# EasyEDA schematic BIT 1.json
TITLE: TRICORE | ALU | LOGIC; REV: 1.0; Date: 2022-01-03; Sheet: 3/9; Drawn By: Koehler, Paul; Company: komed3
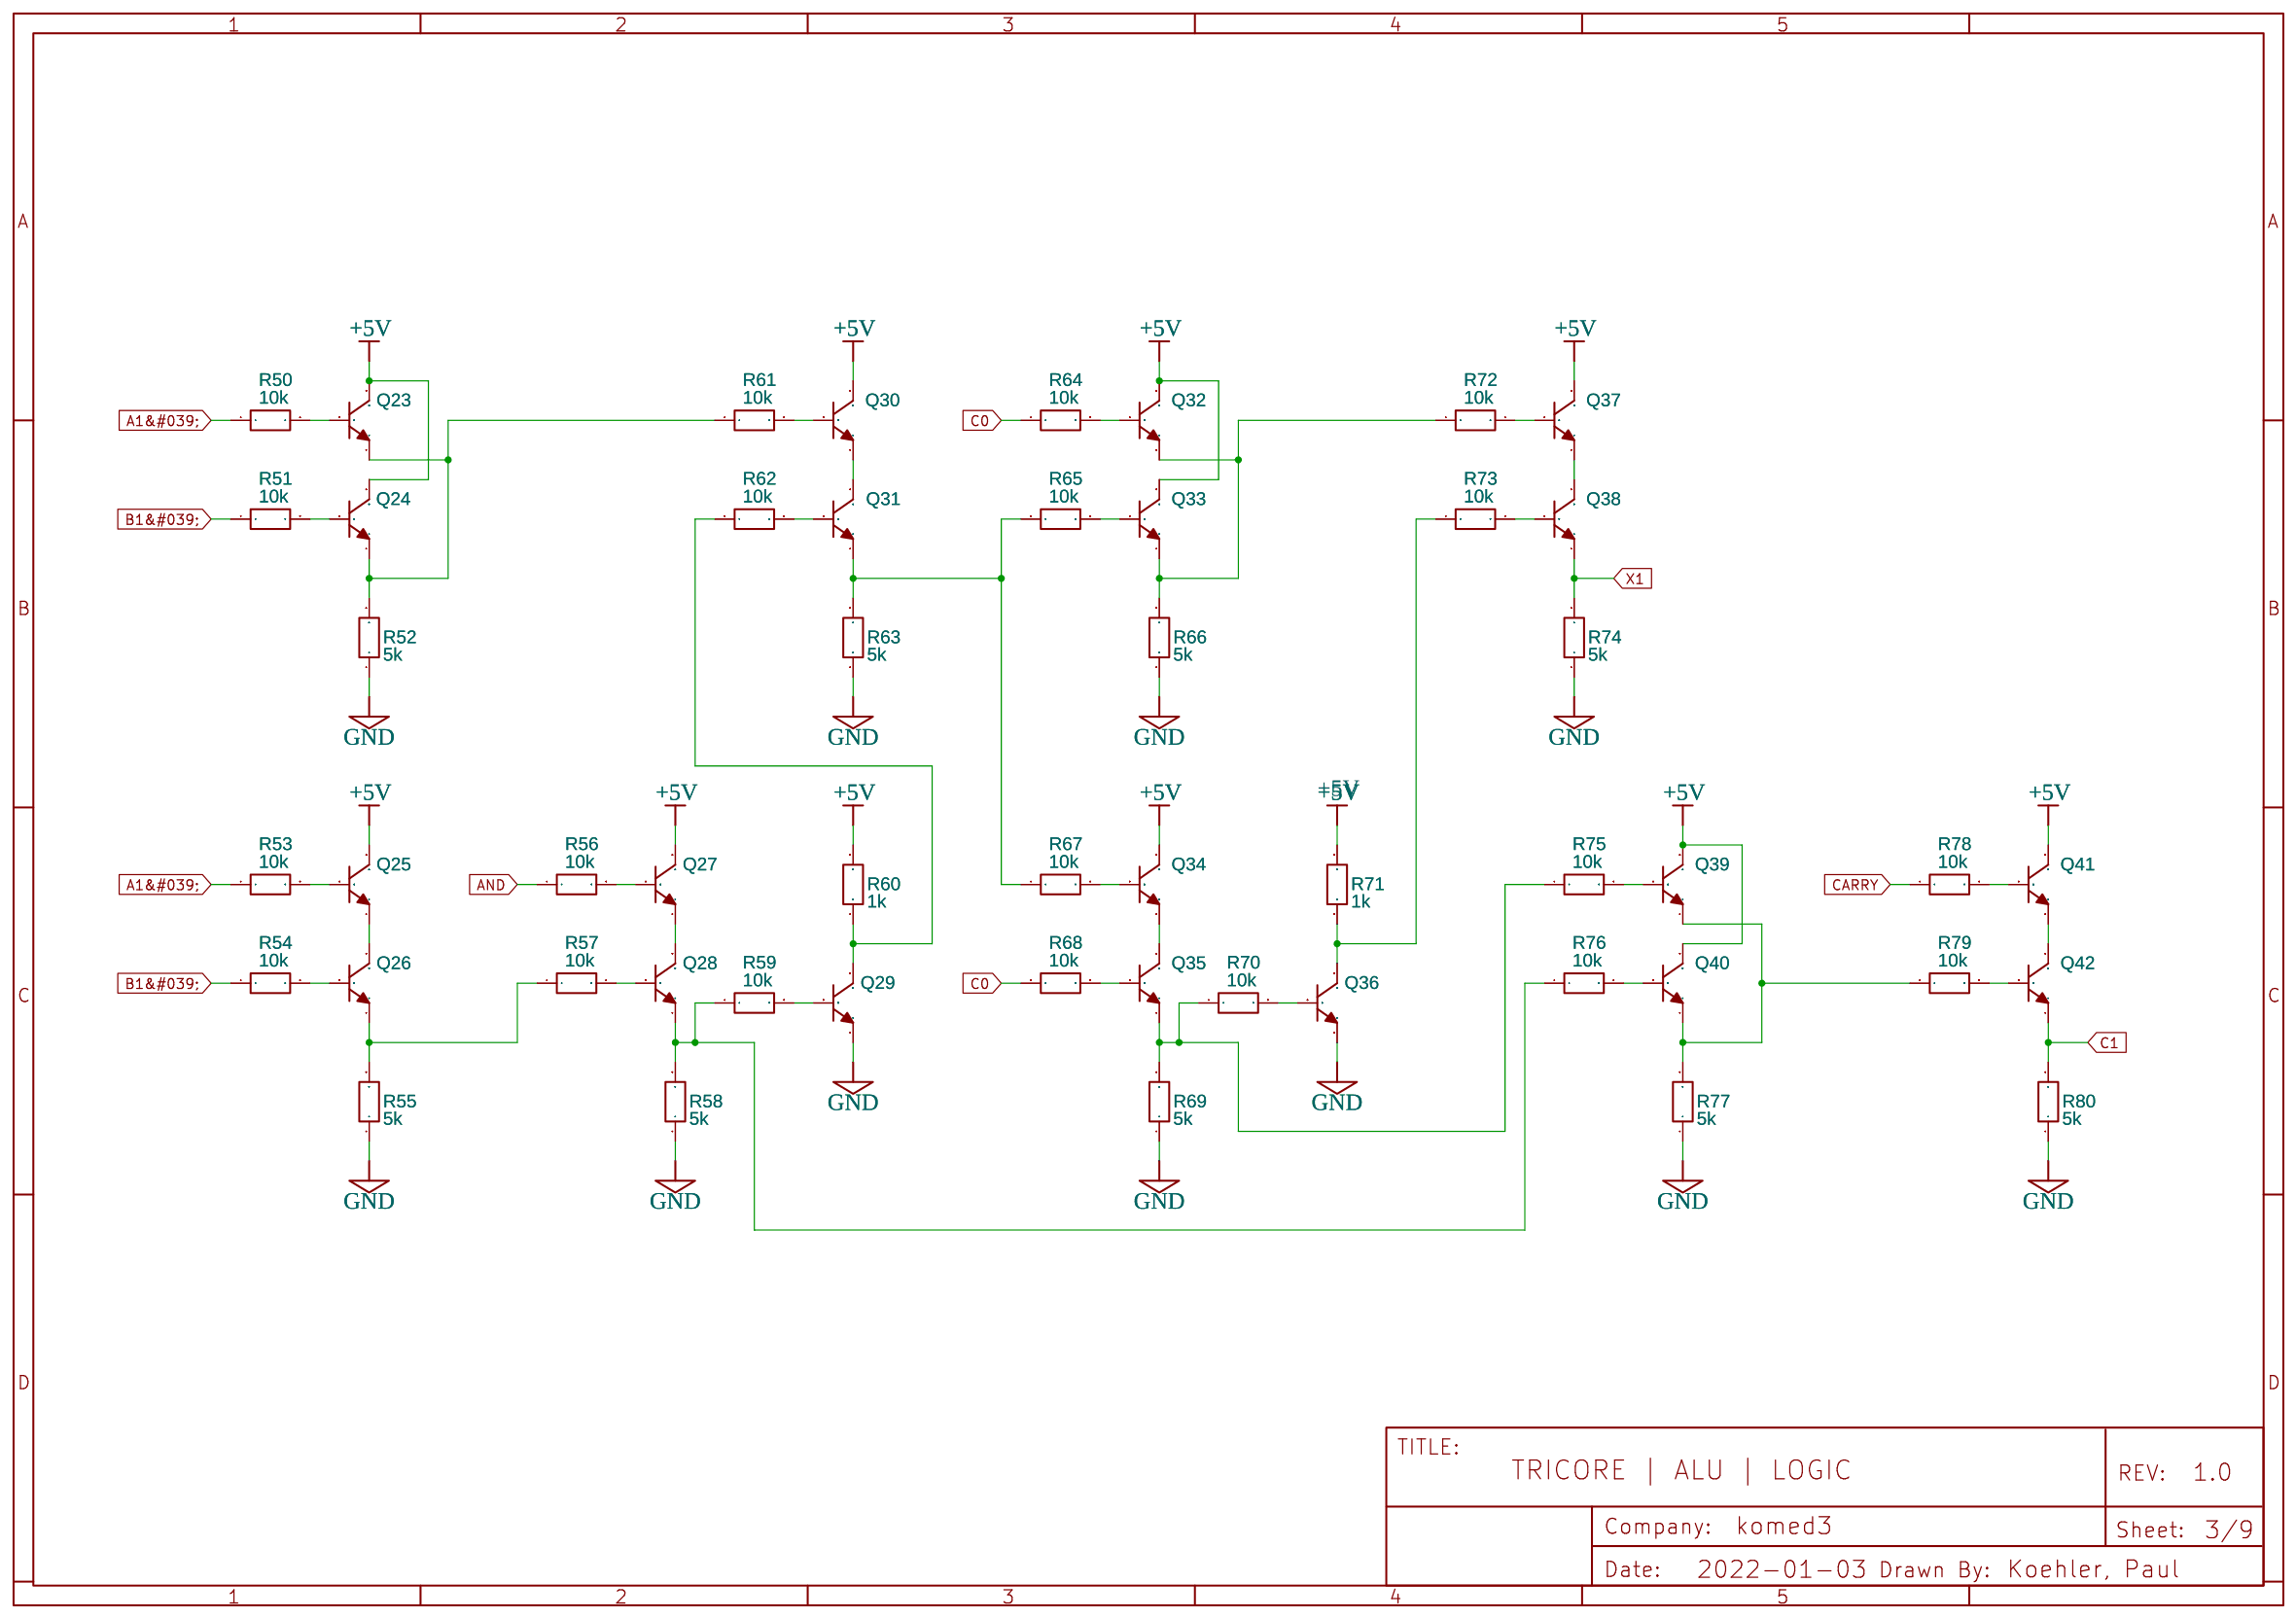
[diagram p0: schematic sheet]

## Parts
Q23  2N3904(TO-92)  [TO-92-3_L5.1-W4.1-P1.27-L]
Q24  2N3904(TO-92)  [TO-92-3_L5.1-W4.1-P1.27-L]
Q25  2N3904(TO-92)  [TO-92-3_L5.1-W4.1-P1.27-L]
Q26  2N3904(TO-92)  [TO-92-3_L5.1-W4.1-P1.27-L]
Q27  2N3904(TO-92)  [TO-92-3_L5.1-W4.1-P1.27-L]
Q28  2N3904(TO-92)  [TO-92-3_L5.1-W4.1-P1.27-L]
Q29  2N3904(TO-92)  [TO-92-3_L5.1-W4.1-P1.27-L]
Q30  2N3904(TO-92)  [TO-92-3_L5.1-W4.1-P1.27-L]
Q31  2N3904(TO-92)  [TO-92-3_L5.1-W4.1-P1.27-L]
Q32  2N3904(TO-92)  [TO-92-3_L5.1-W4.1-P1.27-L]
Q33  2N3904(TO-92)  [TO-92-3_L5.1-W4.1-P1.27-L]
Q34  2N3904(TO-92)  [TO-92-3_L5.1-W4.1-P1.27-L]
Q35  2N3904(TO-92)  [TO-92-3_L5.1-W4.1-P1.27-L]
Q36  2N3904(TO-92)  [TO-92-3_L5.1-W4.1-P1.27-L]
Q37  2N3904(TO-92)  [TO-92-3_L5.1-W4.1-P1.27-L]
Q38  2N3904(TO-92)  [TO-92-3_L5.1-W4.1-P1.27-L]
Q39  2N3904(TO-92)  [TO-92-3_L5.1-W4.1-P1.27-L]
Q40  2N3904(TO-92)  [TO-92-3_L5.1-W4.1-P1.27-L]
Q41  2N3904(TO-92)  [TO-92-3_L5.1-W4.1-P1.27-L]
Q42  2N3904(TO-92)  [TO-92-3_L5.1-W4.1-P1.27-L]
R50  10k  [R_AXIAL-0.3]
R51  10k  [R_AXIAL-0.3]
R52  5k  [R_AXIAL-0.3]
R53  10k  [R_AXIAL-0.3]
R54  10k  [R_AXIAL-0.3]
R55  5k  [R_AXIAL-0.3]
R56  10k  [R_AXIAL-0.3]
R57  10k  [R_AXIAL-0.3]
R58  5k  [R_AXIAL-0.3]
R59  10k  [R_AXIAL-0.3]
R60  1k  [R_AXIAL-0.3]
R61  10k  [R_AXIAL-0.3]
R62  10k  [R_AXIAL-0.3]
R63  5k  [R_AXIAL-0.3]
R64  10k  [R_AXIAL-0.3]
R65  10k  [R_AXIAL-0.3]
R66  5k  [R_AXIAL-0.3]
R67  10k  [R_AXIAL-0.3]
R68  10k  [R_AXIAL-0.3]
R69  5k  [R_AXIAL-0.3]
R70  10k  [R_AXIAL-0.3]
R71  1k  [R_AXIAL-0.3]
R72  10k  [R_AXIAL-0.3]
R73  10k  [R_AXIAL-0.3]
R74  5k  [R_AXIAL-0.3]
R75  10k  [R_AXIAL-0.3]
R76  10k  [R_AXIAL-0.3]
R77  5k  [R_AXIAL-0.3]
R78  10k  [R_AXIAL-0.3]
R79  10k  [R_AXIAL-0.3]
R80  5k  [R_AXIAL-0.3]

## Library data of the parts
Q23-Q42 = 2N3904(TO-92): Supplier: LCSC; Manufacturer: SEMTECH; Manufacturer Part: 2N3904; Supplier Part: C118538; Contributor: LCEDA_Lib
R50-R80 = R_AXIAL-0.3_EU: Contributor: LCEDA_Lib

## Nets
+5V: Q23.3(C) Q24.3(C) Q25.3(C) Q27.3(C) Q30.3(C) Q32.3(C) Q33.3(C) Q34.3(C) Q37.3(C) Q39.3(C) Q40.3(C) Q41.3(C) R60.2 R71.2
GND: Q29.1(E) Q36.1(E) R52.1 R55.1 R58.1 R63.1 R66.1 R69.1 R74.1 R77.1 R80.1
A1&#039;: R50.1 R53.1
AND: R56.1
B1&#039;: R51.1 R54.1
C0: R64.1 R68.1
C1: Q42.1(E) R80.2
CARRY: R78.1
X1: Q38.1(E) R74.2
Net-(Q23-1): Q23.1(E) Q24.1(E) R52.2 R61.1
Net-(Q23-2): Q23.2(B) R50.2
Net-(Q24-2): Q24.2(B) R51.2
Net-(Q25-1): Q25.1(E) Q26.3(C)
Net-(Q25-2): Q25.2(B) R53.2
Net-(Q26-1): Q26.1(E) R55.2 R57.1
Net-(Q26-2): Q26.2(B) R54.2
Net-(Q27-1): Q27.1(E) Q28.3(C)
Net-(Q27-2): Q27.2(B) R56.2
Net-(Q28-1): Q28.1(E) R58.2 R59.1 R76.1
Net-(Q28-2): Q28.2(B) R57.2
Net-(Q29-2): Q29.2(B) R59.2
Net-(Q29-3): Q29.3(C) R60.1 R62.1
Net-(Q30-1): Q30.1(E) Q31.3(C)
Net-(Q30-2): Q30.2(B) R61.2
Net-(Q31-1): Q31.1(E) R63.2 R65.1 R67.1
Net-(Q31-2): Q31.2(B) R62.2
Net-(Q32-1): Q32.1(E) Q33.1(E) R66.2 R72.1
Net-(Q32-2): Q32.2(B) R64.2
Net-(Q33-2): Q33.2(B) R65.2
Net-(Q34-1): Q34.1(E) Q35.3(C)
Net-(Q34-2): Q34.2(B) R67.2
Net-(Q35-1): Q35.1(E) R69.2 R70.1 R75.1
Net-(Q35-2): Q35.2(B) R68.2
Net-(Q36-2): Q36.2(B) R70.2
Net-(Q36-3): Q36.3(C) R71.1 R73.1
Net-(Q37-1): Q37.1(E) Q38.3(C)
Net-(Q37-2): Q37.2(B) R72.2
Net-(Q38-2): Q38.2(B) R73.2
Net-(Q39-1): Q39.1(E) Q40.1(E) R77.2 R79.1
Net-(Q39-2): Q39.2(B) R75.2
Net-(Q40-2): Q40.2(B) R76.2
Net-(Q41-1): Q41.1(E) Q42.3(C)
Net-(Q41-2): Q41.2(B) R78.2
Net-(Q42-2): Q42.2(B) R79.2

## Notes on the sheet
- +5V
